# Altium schematic sheet MLX75123.SchDoc
size A
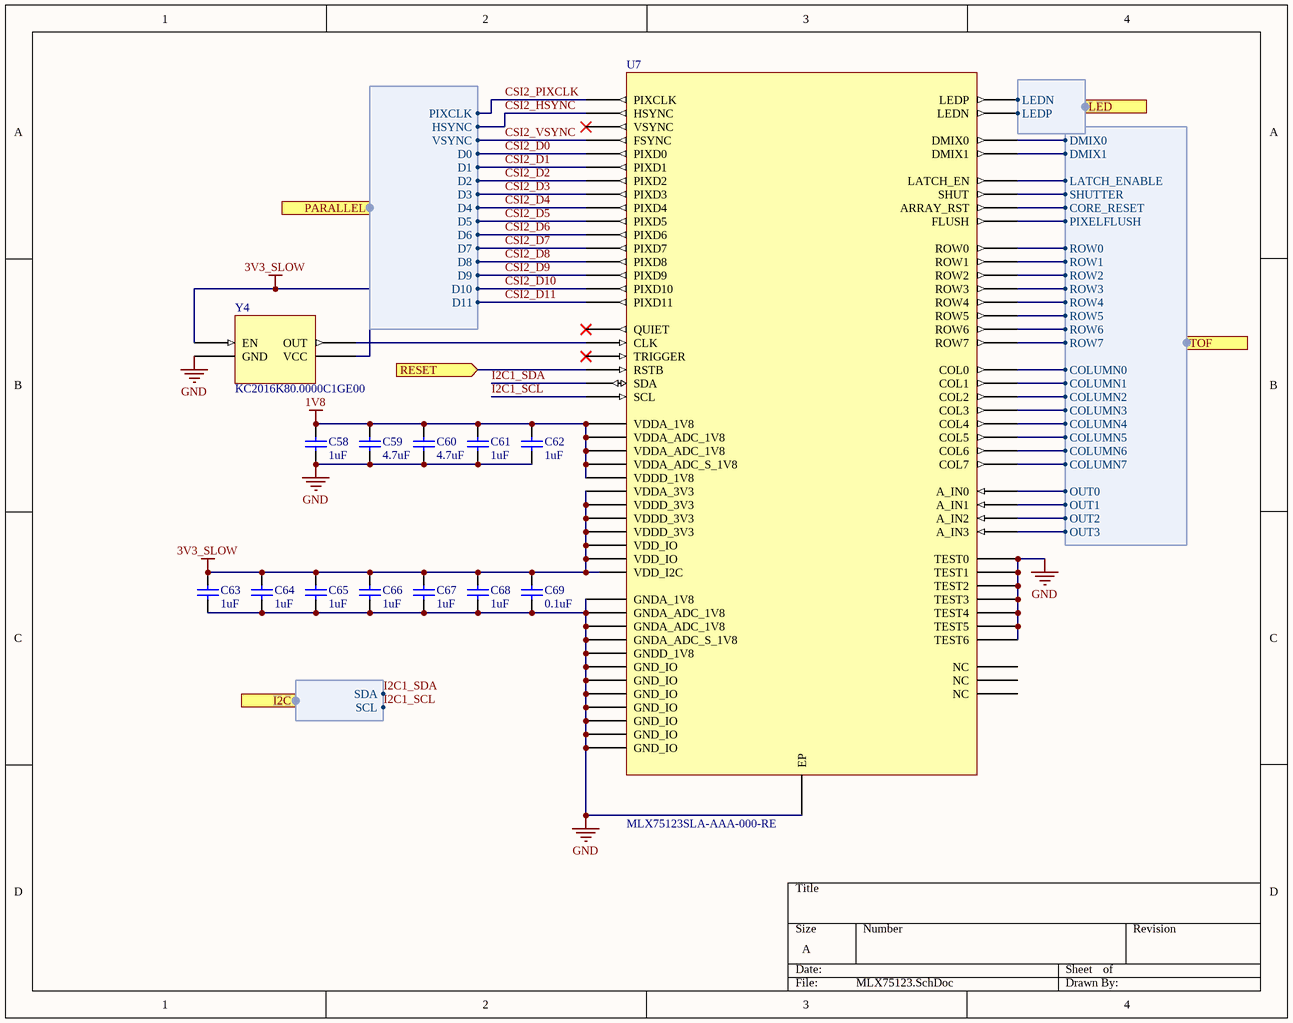
[diagram p0: MLX75123.SchDoc]

## Parts
C58  value 1uF  [C0402[1005X55]]  (hidden comment: 1uF 6.3V 0402)
C59  value 4.7uF  [C0402[1005X55]]  (hidden comment: 4.7uF 6.3V 0402)
C60  value 4.7uF  [C0402[1005X55]]  (hidden comment: 4.7uF 6.3V 0402)
C61  value 1uF  [C0402[1005X55]]  (hidden comment: 1uF 6.3V 0402)
C62  value 1uF  [C0402[1005X55]]  (hidden comment: 1uF 6.3V 0402)
C63  value 1uF  [C0402[1005X55]]  (hidden comment: 1uF 6.3V 0402)
C64  value 1uF  [C0402[1005X55]]  (hidden comment: 1uF 6.3V 0402)
C65  value 1uF  [C0402[1005X55]]  (hidden comment: 1uF 6.3V 0402)
C66  value 1uF  [C0402[1005X55]]  (hidden comment: 1uF 6.3V 0402)
C67  value 1uF  [C0402[1005X55]]  (hidden comment: 1uF 6.3V 0402)
C68  value 1uF  [C0402[1005X55]]  (hidden comment: 1uF 6.3V 0402)
C69  value 0.1uF  [C0402[1005X55]]  (hidden comment: 0.1uF 6.3V 0402)
U7  MLX75123SLA-AAA-000-RE  [AQFN-84]
Y4  KC2016K80.0000C1GE00  [KC2016K]

## Ports
I2C (harness I2C), LED (harness LED), PARALLEL (harness Parallel), RESET (in), TOF (harness TOF)

## Harnesses
Parallel: D2, D3, D1, D0, D6, D7, D5, D4, D10, D9, D8, PIXCLK, D11, HSYNC, VSYNC
I2C: SCL, SDA
TOF: DMIX1, DMIX0, SHUTTER, COLUMN0, COLUMN1, COLUMN2, COLUMN4, COLUMN3, COLUMN5, COLUMN6, COLUMN7, LATCH_ENABLE, ROW0, ROW1, ROW2, ROW3, ROW4, ROW5, ROW6, ROW7, CORE_RESET, PIXELFLUSH, OUT0, OUT1, OUT2, OUT3
LED: LEDP, LEDN

## Nets
1V8: C58.2 C59.2 C60.2 C61.2 C62.2 U7.A9(VDDA_ADC_1V8) U7.A10(VDDA_ADC_S_1V8) U7.B5(VDDA_ADC_1V8) U7.B14(VDDA_1V8) U7.B20(VDDD_1V8)
3V3_SLOW: C63.2 C64.2 C65.2 C66.2 C67.2 C68.2 C69.2 U7.A36(VDDD_3V3) U7.B4(VDDA_3V3) U7.B12(VDD_I2C) U7.B17(VDDD_3V3) U7.B21(VDD_IO) U7.B30(VDD_IO) U7.B38(VDDD_3V3) Y4.1(EN) Y4.4(VCC)
GND: C58.1 C59.1 C60.1 C61.1 C62.1 C63.1 C64.1 C65.1 C66.1 C67.1 C68.1 C69.1 U7.A5(GNDA_ADC_1V8) U7.A8(GND_IO) U7.A11(TEST5) U7.A16(GNDA_1V8) U7.A17(TEST3) U7.A18(GND_IO) U7.A21(TEST0) U7.A22(GNDD_1V8) U7.A24(GND_IO) U7.A33(GND_IO) U7.A41(GND_IO) U7.B8(GNDA_ADC_1V8) U7.B9(GNDA_ADC_S_1V8) U7.B10(TEST6) U7.B15(GND_IO) U7.B16(TEST4) U7.B18(TEST2) U7.B19(TEST1) U7.B33(GND_IO) U7.EP Y4.2(GND)
CSI2_D0: U7.A30(PIXD0) ; port PARALLEL.D0
CSI2_D1: U7.B27(PIXD1) ; port PARALLEL.D1
CSI2_D2: U7.A29(PIXD2) ; port PARALLEL.D2
CSI2_D3: U7.B26(PIXD3) ; port PARALLEL.D3
CSI2_D4: U7.A28(PIXD4) ; port PARALLEL.D4
CSI2_D5: U7.B25(PIXD5) ; port PARALLEL.D5
CSI2_D6: U7.A27(PIXD6) ; port PARALLEL.D6
CSI2_D7: U7.B24(PIXD7) ; port PARALLEL.D7
CSI2_D8: U7.A26(PIXD8) ; port PARALLEL.D8
CSI2_D9: U7.B23(PIXD9) ; port PARALLEL.D9
CSI2_D10: U7.A25(PIXD10) ; port PARALLEL.D10
CSI2_D11: U7.B22(PIXD11) ; port PARALLEL.D11
CSI2_HSYNC: U7.B29(HSYNC) ; port PARALLEL.HSYNC
CSI2_PIXCLK: U7.B28(PIXCLK) ; port PARALLEL.PIXCLK
CSI2_VSYNC: U7.A31(FSYNC) ; port PARALLEL.VSYNC
I2C1_SCL: U7.A12(SCL) ; port I2C.SCL
I2C1_SDA: U7.B11(SDA) ; port I2C.SDA
RESET: U7.A14(RSTB) ; port RESET
NetU7_A1: U7.A1(ROW5) ; port TOF.ROW5
NetU7_A2: U7.A2(ROW7) ; port TOF.ROW7
NetU7_A3: U7.A3(ARRAY_RST) ; port TOF.CORE_RESET
NetU7_A4: U7.A4(LATCH_EN) ; port TOF.LATCH_ENABLE
NetU7_A6: U7.A6(A_IN1) ; port TOF.OUT1
NetU7_A7: U7.A7(A_IN2) ; port TOF.OUT2
NetU7_A34: U7.A34(LEDN) ; port LED.LEDP
NetU7_A35: U7.A35(DMIX0) ; port TOF.DMIX0
NetU7_A37: U7.A37(COL7) ; port TOF.COLUMN7
NetU7_A38: U7.A38(COL5) ; port TOF.COLUMN5
NetU7_A39: U7.A39(COL3) ; port TOF.COLUMN3
NetU7_A40: U7.A40(COL1) ; port TOF.COLUMN1
NetU7_A42: U7.A42(ROW0) ; port TOF.ROW0
NetU7_A43: U7.A43(ROW2) ; port TOF.ROW2
NetU7_A44: U7.A44(ROW4) ; port TOF.ROW4
NetU7_B1: U7.B1(ROW6) ; port TOF.ROW6
NetU7_B2: U7.B2(SHUT) ; port TOF.SHUTTER
NetU7_B3: U7.B3(FLUSH) ; port TOF.PIXELFLUSH
NetU7_B6: U7.B6(A_IN0) ; port TOF.OUT0
NetU7_B7: U7.B7(A_IN3) ; port TOF.OUT3
NetU7_B13: U7.B13(CLK) Y4.3(OUT)
NetU7_B31: U7.B31(LEDP) ; port LED.LEDN
NetU7_B32: U7.B32(DMIX1) ; port TOF.DMIX1
NetU7_B34: U7.B34(COL6) ; port TOF.COLUMN6
NetU7_B35: U7.B35(COL4) ; port TOF.COLUMN4
NetU7_B36: U7.B36(COL2) ; port TOF.COLUMN2
NetU7_B37: U7.B37(COL0) ; port TOF.COLUMN0
NetU7_B39: U7.B39(ROW1) ; port TOF.ROW1
NetU7_B40: U7.B40(ROW3) ; port TOF.ROW3

Not connected (* = marked no-connect by the designer): U7 A13(TRIGGER)* A15(QUIET)* A19(NC) A20(NC) A23(NC) A32(VSYNC)*

## Library data of the parts
C58 C61-C68 = CAP_1uF_6.3V_0402_10%: 1uF 6.3V 10% 0402 (1005 Metric); PartNumber: GRM155R70J105KA12D; Manufacturer: Murata; Mounting Technology: Surface Mount; PackageReference: 0402; PackageDescription: 0402 (1005 Metric); Voltage: 6.3V; Tolerance: 10%
C59 C60 = CAP_4.7uF_6.3V_0402_20%: 4.7uF 6.3V 20% 0402 (1005 Metric); PartNumber: GRM155R60J475ME47D; Manufacturer: Murata; Mounting Technology: Surface Mount; PackageReference: 0402; PackageDescription: 0402 (1005 Metric); Voltage: 6.3V; Tolerance: 20%
C69 = CAP_0.1uF_6.3V_0402_10%: 0.1uF 6.3V 10% 0402 (1005 Metric); PartNumber: GRM155R70J104KA01D; Manufacturer: Murata; Mounting Technology: Surface Mount; PackageReference: 0402; PackageDescription: 0402 (1005 Metric); Voltage: 6.3V; Tolerance: 10%
U7 = MLX75123SLA-AAA-000-RE: Sensor Interface ToF Companion Chip; Manufacturer: Melexis; PackageReference: AQFN-84; Mounting Technology: Surface Mount; PartNumber: MLX75123SLA-AAA-000-RE
Y4 = KC2016K80.0000C1GE00: OSC XO 80.0000MHZ CMOS SMD; Manufacturer: AVX; PartNumber: KC2016K80.0000C1GE00; Mounting Technology: Surface Mount; PackageReference: SMD-4